# Altium project Aplificador.PrjPcb
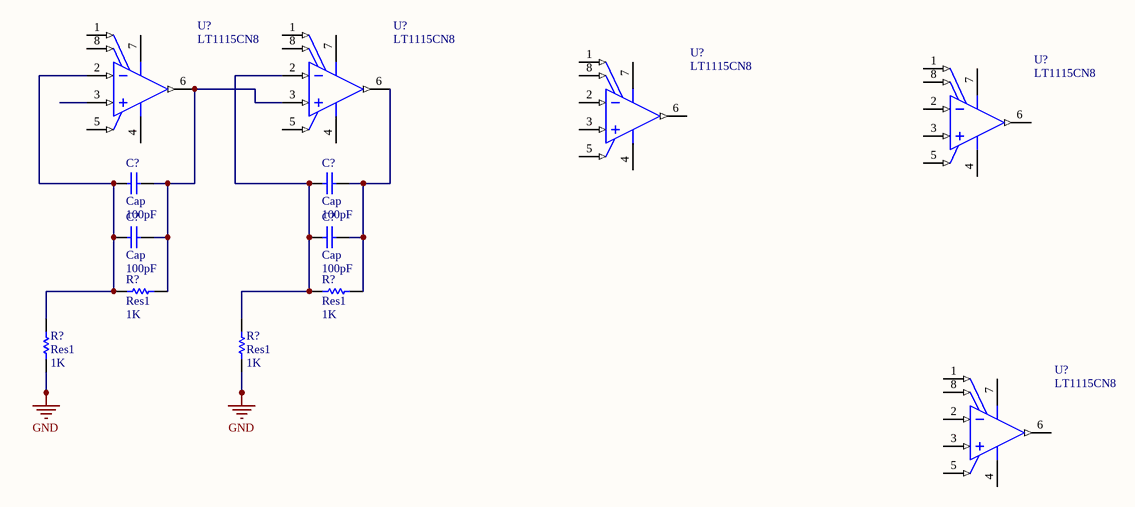
[diagram p0: Sheet1.SchDoc]
1 sheet, 13 parts. Net scope: global (net labels, ports and power ports of the same name join across sheets).

## Sheet Sheet1.SchDoc
size A4

### Parts
(Parts that share a designator on the sheet are numbered #1, #2 ... from top to bottom, then left to right.)
C?#1  Cap  value 100pF  [RAD-0.3]
C?#2  Cap  value 100pF  [RAD-0.3]
C?#3  Cap  value 100pF  [RAD-0.3]
C?#4  Cap  value 100pF  [RAD-0.3]
R?#1  Res1  value 1K  [AXIAL-0.3]
R?#2  Res1  value 1K  [AXIAL-0.3]
R?#3  Res1  value 1K  [AXIAL-0.3]
R?#4  Res1  value 1K  [AXIAL-0.3]
U?#1  LT1115CN8  [LT-N8-8]
U?#2  LT1115CN8  [LT-N8-8]
U?#3  LT1115CN8  [LT-N8-8]
U?#4  LT1115CN8  [LT-N8-8]
U?#5  LT1115CN8  [LT-N8-8]

### Nets
GND: R?#3.1 R?#4.1
NetC?#1_1: C?#1.1 C?#3.1 R?#1.1 R?#3.2 U?#1.2(-IN)
NetC?#1_2: C?#1.2 C?#3.2 R?#1.2 U?#1.6(OUT) U?#2.3(+IN)
NetC?#2_1: C?#2.1 C?#4.1 R?#2.1 R?#4.2 U?#2.2(-IN)
NetC?#2_2: C?#2.2 C?#4.2 R?#2.2 U?#2.6(OUT)

Not connected (* = marked no-connect by the designer): U?#1 1(VOS_TRIM) 3(+IN) 4(V-) 5(OVER-COMP) 7(V+) 8(VOS_TRIM); U?#2 1(VOS_TRIM) 4(V-) 5(OVER-COMP) 7(V+) 8(VOS_TRIM); U?#3 1(VOS_TRIM) 2(-IN) 3(+IN) 4(V-) 5(OVER-COMP) 6(OUT) 7(V+) 8(VOS_TRIM); U?#4 1(VOS_TRIM) 2(-IN) 3(+IN) 4(V-) 5(OVER-COMP) 6(OUT) 7(V+) 8(VOS_TRIM); U?#5 1(VOS_TRIM) 2(-IN) 3(+IN) 4(V-) 5(OVER-COMP) 6(OUT) 7(V+) 8(VOS_TRIM)

### Library data of the parts
C?#1-C?#4 = Cap: Capacitor; Published: 8-Jun-2000; LatestRevisionDate: 17-Jul-2002; LatestRevisionNote: Re-released for DXP Platform.; PackageReference: RAD-0.3; Publisher: Altium Limited; PackageDescription: Radial Cap, Thru-Hole; 2 Leads; 0.3 in Pin Spacing
R?#1-R?#4 = Res1: Resistor; Published: 8-Jun-2000; LatestRevisionDate: 17-Jul-2002; LatestRevisionNote: Re-released for DXP Platform.; PackageReference: AXIAL-0.3; Publisher: Altium Limited; PackageDescription: Axial Device, Thru-Hole; 2 Leads; 0.3 in Pin Spacing
U?#1-U?#5 = LT1115CN8: Single Channel, Low Noise, Ultra Low Distortion Operational Amplifier, 70 MHz Typical GBW, 15 V/us Typical SR, 8 to 44 V, 8-Pin DIP (N8-8), Commercial; Linear Technology Part Number: LT1115; Manufacturer: Linear Technology; Channels (#): 1; GBW (MHz) Typical: 70; Is (mA) Typical: 8.5; SR (V/us) Typical: 15; Vos (mV) Typical: 0.05; Vs Max (V): 44; Vs Min (V): 8; DatasheetVersion: Rev. A; PackageVersion: Rev I; PackageReference: LT-N8-8; PackageDescription: 8-Lead PDIP, Body 10.16 x 6.48 mm, Pitch 2.54 mm; Type: VFB; Mounting Technology: Through Hole; PartNumber: LT1115CN8; ComponentLink1Description: Manufacturer URL; ComponentLink1URL: http://www.linear.com/; ComponentLink2Description: Datasheet; ComponentLink2URL: http://cds.linear.com/docs/en/datasheet/lt1115fa.pdf; ComponentLink3Description: Package Specification; ComponentLink3URL: http://cds.linear.com/docs/en/packaging/05081510_I_N8.pdf